# EAGLE design ASL2001 (EAGLE 6.3)
DATABASE: ./../../../../../Components/TinyCircuits_Part_Database.txt
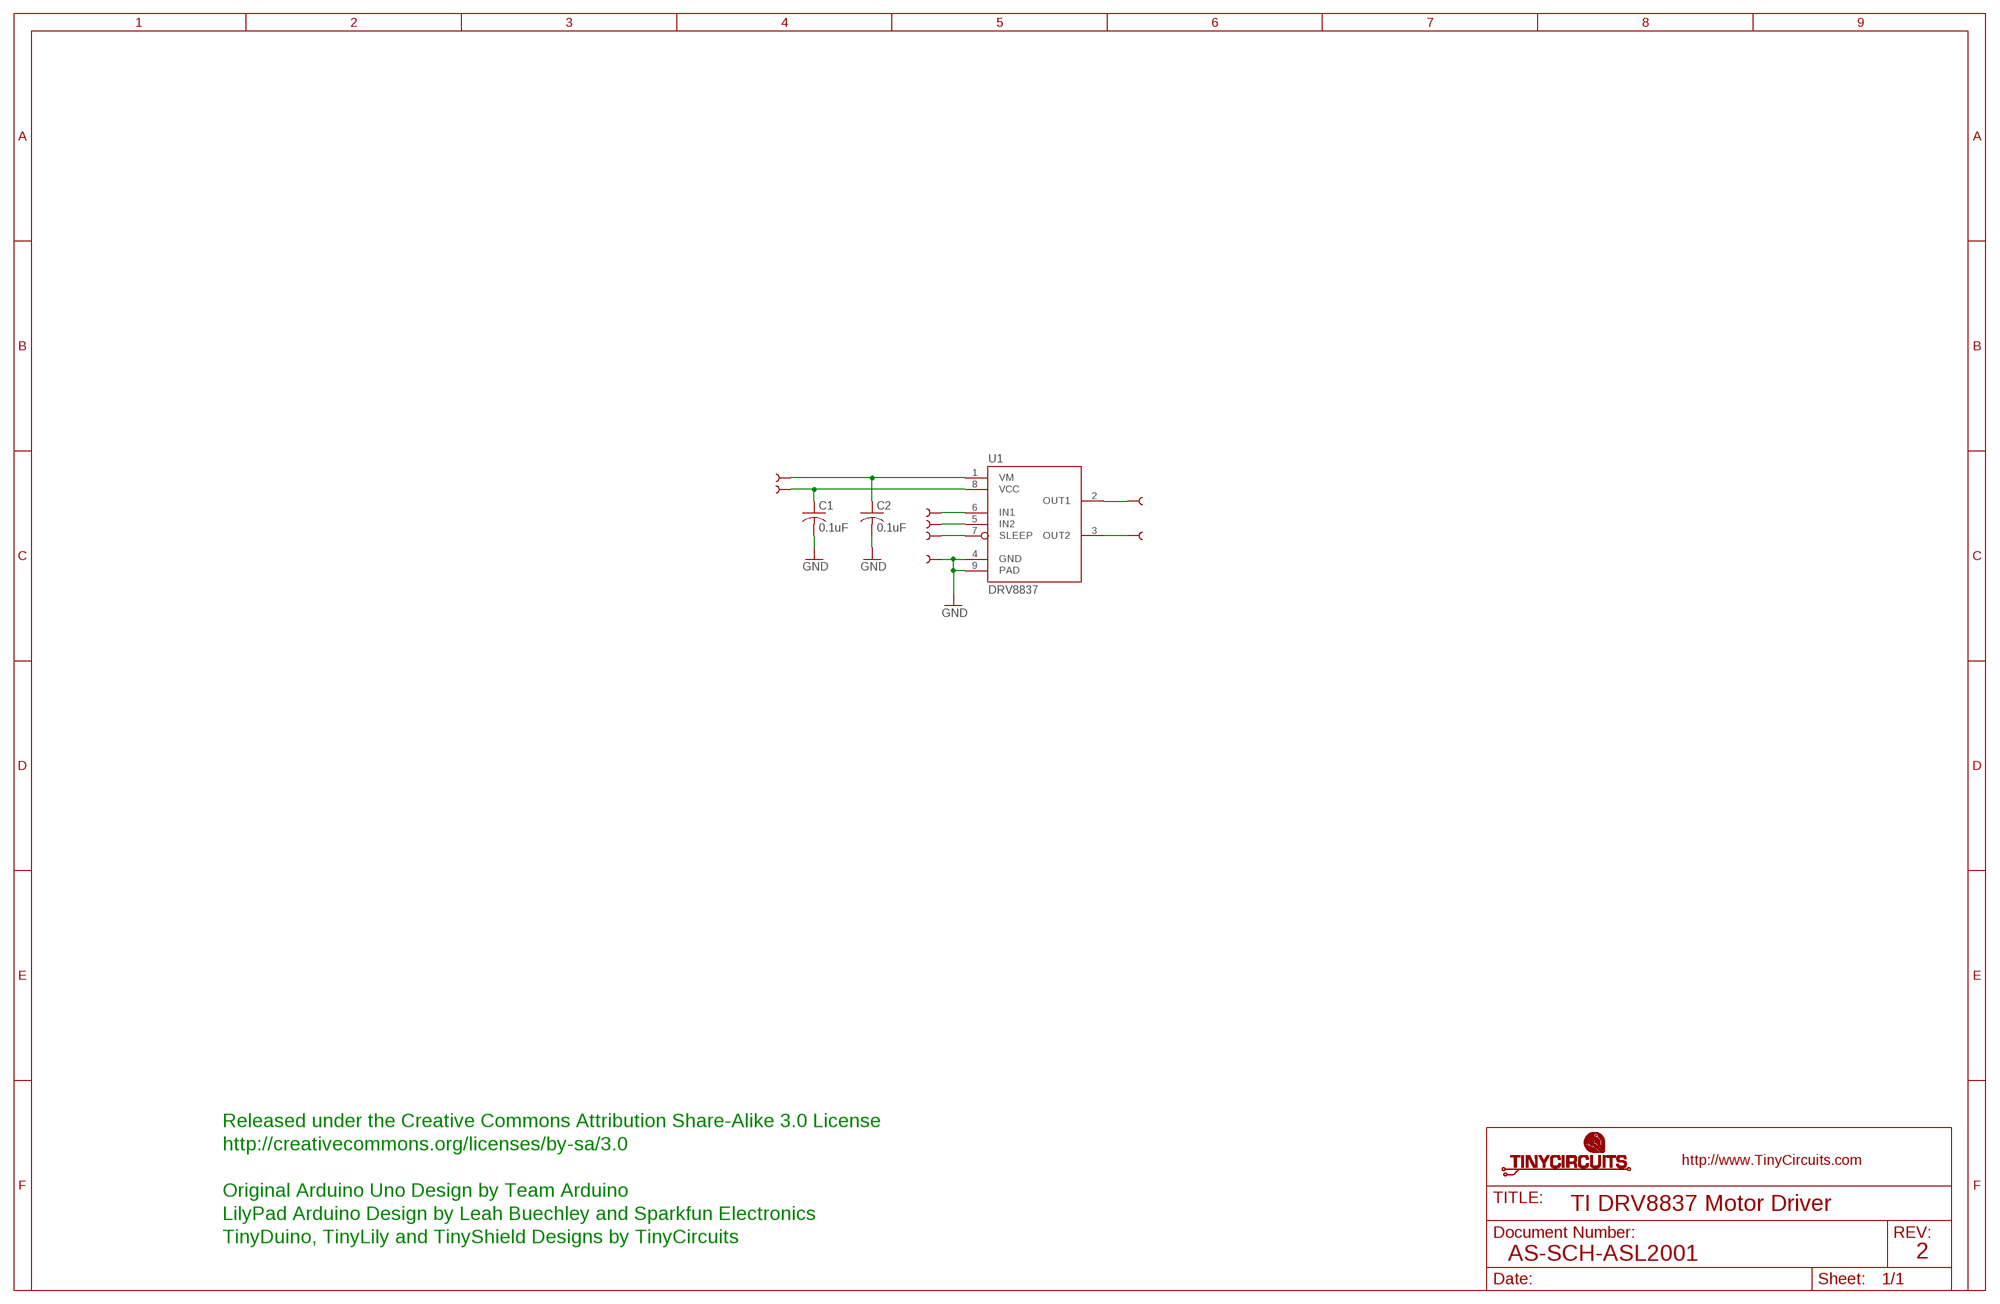
[diagram p0: schematic, sheet 1]

## Parts
C1  0.1uF  AS-ITM-00008  [C0402]
C2  0.1uF  AS-ITM-00008  [C0402]
U1  DRV8837  AS-ITM-00042  [WSON-8]
U$2  SEWTABTH_0402  [SEWTAP_TH_0402]
U$3  SEWTABTH_0402  [SEWTAP_TH_0402]
U$4  SEWTABTH_0402  [SEWTAP_TH_0402]
U$5  SEWTABTH_0402  [SEWTAP_TH_0402]
U$8  SEWTABTH_0402  [SEWTAP_TH_0402]
U$9  SEWTABTH_0402  [SEWTAP_TH_0402]
U$10  SEWTABTH_0402  [SEWTAP_TH_0402]
U$11  SEWTABTH_0402  [SEWTAP_TH_0402]

## Nets
GND: C1.2 C2.2 U1.4(GND) U1.9(PAD) U$9.1
N$3: C1.1 U1.8(VCC) U$2.1
N$4: U1.7(SLEEP) U$8.1
N$5: U1.5(IN2) U$5.1
N$6: U1.6(IN1) U$4.1
N$7: C2.1 U1.1(VM) U$3.1
N$9: U1.2(OUT1) U$10.1
N$10: U1.3(OUT2) U$11.1

## Notes on the sheet
- Released under the Creative Commons Attribution Share-Alike 3.0 License
- http://creativecommons.org/licenses/by-sa/3.0
- Original Arduino Uno Design by Team Arduino
- TI DRV8837 Motor Driver
- LilyPad Arduino Design by Leah Buechley and Sparkfun Electronics
- TinyDuino, TinyLily and TinyShield Designs by TinyCircuits
- AS-SCH-ASL2001 | 2

## Library data of the parts
C1 C2 = tinycircuits:AS-ITM-00008: CAP CER 0.1UF 16V 10% X5R 0402; PARTNO: AS-ITM-00008
U1 = tinycircuits:AS-ITM-00042: IC PWM MOTR DVR H-BRDG 8WSON; PARTNO: AS-ITM-00042
U$2-U$5 U$8-U$11 = tinycircuits:SEWTAB: TinyLily Sew Tab; BOM: EXCLUDE; DNP: T

## Board
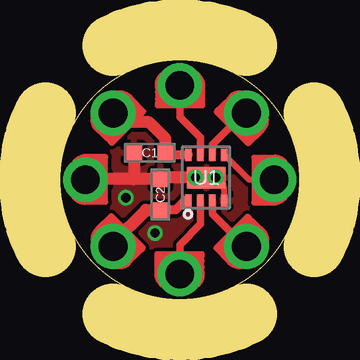
[diagram p1: board, top side]
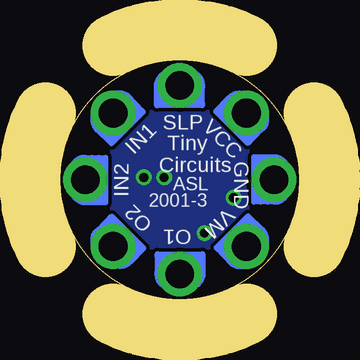
[diagram p2: board, bottom side, seen from below]

Size 10 x 10 mm. Coordinates in mm from the lower left corner, seen from the top.
Outline: circle at 5,5 radius 5
Copper layers (1*16): Top 0.035mm / dielectric 1.5mm / Bottom 0.035mm
Design rules "default": minimum track width 8mil, minimum drill 15mil, track to track 6mil, track to pad 6mil, pad to pad 6mil, via to via 6mil, smd to smd 6mil, copper to edge 6mil, drill to drill 8mil, minimum pad ring 8mil, minimum via ring 5mil, stop-mask expansion 4mil, vias tented up to drill 25mil, thermal gap 10mil
Milling: 4 lines

### Footprints (pad centres in the part's own frame; a part is rotated, then mirrored left to right if it is on the bottom)
C0402 = smd 0.65 x 0.6: 1 -0.65,0; 2 0.65,0
WSON-8 = smd 0.28 x 0.5: 1 -0.75,-0.95; 2 -0.25,-0.95; 3 0.25,-0.95; 4 0.75,-0.95; 5 0.75,0.95; 6 0.25,0.95; 7 -0.25,0.95; 8 -0.75,0.95 | smd 1.6 x 0.9: 9 0,0
SEWTAP_TH_0402 = drill 1.2 pad 1.867: 1 0,0

### Placement (x,y rotation side)
C1  3.75,6.13 180 top
C2  4.19,4.38 90 top
U1  6.11,5.09 0 top
U$2  2.22,7.78 225 bottom
U$3  2.22,2.22 135 bottom
U$4  7.78,7.78 315 bottom
U$5  8.94,5 0 bottom
U$6  [DOCFIELD-TINYCIRCUITS-PCB]  29,-15 0 top  (outside the outline)
U$8  5,8.94 270 bottom
U$9  1.06,5 180 bottom
U$10  5,1.06 90 bottom
U$11  7.78,2.22 45 bottom

### Tracks (layer width: path | path; a pad name or v marks a point on that pad's centre or on a via)
GND  (via drill 0.38)
  Top 0.254: U1.4 6.86,4.61 6.59,4.89 6.31,4.89 U1.9 | 4.26,5.09 C2.2 | 1.09,5.03 U$9.1 | 3.1,5.07 3.05,5.03
  Top 0.508: U1.9 4.26,5.09 | C2.2 3.05,5.03 1.09,5.03 | C1.2 3.1,5.07
  other vias: 2.75,4.25 6.5,5.1 5.65,5.1 3.97,2.77
  pour Bottom: 9.8,5 arc-180 0.2,5 arc-180
  pour Top: 9.8,5 arc-180 0.2,5 arc-180
N$3
  Top 0.254: 4.48,6.04 C1.1 | 2.6,7.4 U$2.1
  Top 0.381: U1.8 4.48,6.04
  Top 0.508: C1.1 4.4,6.72 3.71,7.4 2.6,7.4
N$4
  Top 0.254: U$8.1
  Top 0.305: U1.7 5.86,6.76 5.01,7.61 U$8.1
N$5
  Top 0.254: U$5.1 7.9,5 U1.5
N$6
  Top 0.254: U$4.1 7.67,7.78 | U1.6
  Top 0.305: 7.67,7.78 6.36,6.46 U1.6
N$7
  Top 0.254: U1.1 5.23,4.14 | 4.21,3.75 C2.1 4.18,3.75 | U$3.1 2.22,2.38
  Top 0.381: 5.23,4.14 4.83,3.75 4.21,3.75
  Top 0.508: 2.22,2.38 3.59,3.75 4.18,3.75
N$9
  Top 0.254: 5.87,4.13 U1.2
  Top 0.305: U$10.1 5,2.29 5.87,3.16 5.87,4.13
N$10
  Top 0.254: U$11.1 7.75,2.17 | 6.36,4.12 U1.3
  Top 0.305: 7.75,2.17 6.36,3.57 6.36,4.12

### Text on the board
bPlace: SLP | Tiny | VCC | GND | Circuits | IN1 | ASL | VM | 2001-3 | IN2 | O1 | O2
Document: FABRICATION DRAWING | NOTES: | 1. PRINTED CIRCUIT BOARD MADE FROM NEMA GRADE FR-4 EPOXY LAMINATE | WITH 1 OUNCE COPPER PLATING AND .024 THICKNESS. | 2. ALL DIMENSIONS ARE GIVEN IN INCHES. | 3. CIRCUIT PATHS ARE FOR REFERENCE ONLY. | 4. HOLE SIZES SHOWN ARE FINISHED DIAMETERS AFTER PLATING. | 5. BOARD PLATED USING REFLOW OR SIMILAR METHOD. | 6. BOARD TO HAVE BLUE SOLDER MASK ON PLATED SURFACES USING WET FILM | 7. SILKSCREEN BOARD USING WHITE INK. | SR100 OR SR1010 EPOXY. EQUIVALENT WET OR DRY FILM MAY BE USED. | 8. THE FOLLOWING INFORMATION APPLIES TO THIS BOARD: | * 2 COPPER LAYERS | * .024 BOARD THICKNESS | * REQUIRES TOP SIDE SILKSCREEN | Released under the Creative Commons Attribution Share-Alike 3.0 License | http://creativecommons.org/licenses/by-sa/3.0 | LilyPad Arduino Design by Leah Buechley and Sparkfun Electronics | Original Arduino Uno Design by Team Arduino | TinyDuino, TinyLily and TinyShield Designs by TinyCircuits | TI DRV8837 Motor Driver | AS-PCB-ASL2001 | 2